# EAGLE design AVC But witn an RP2040 (EAGLE 9.6.2)
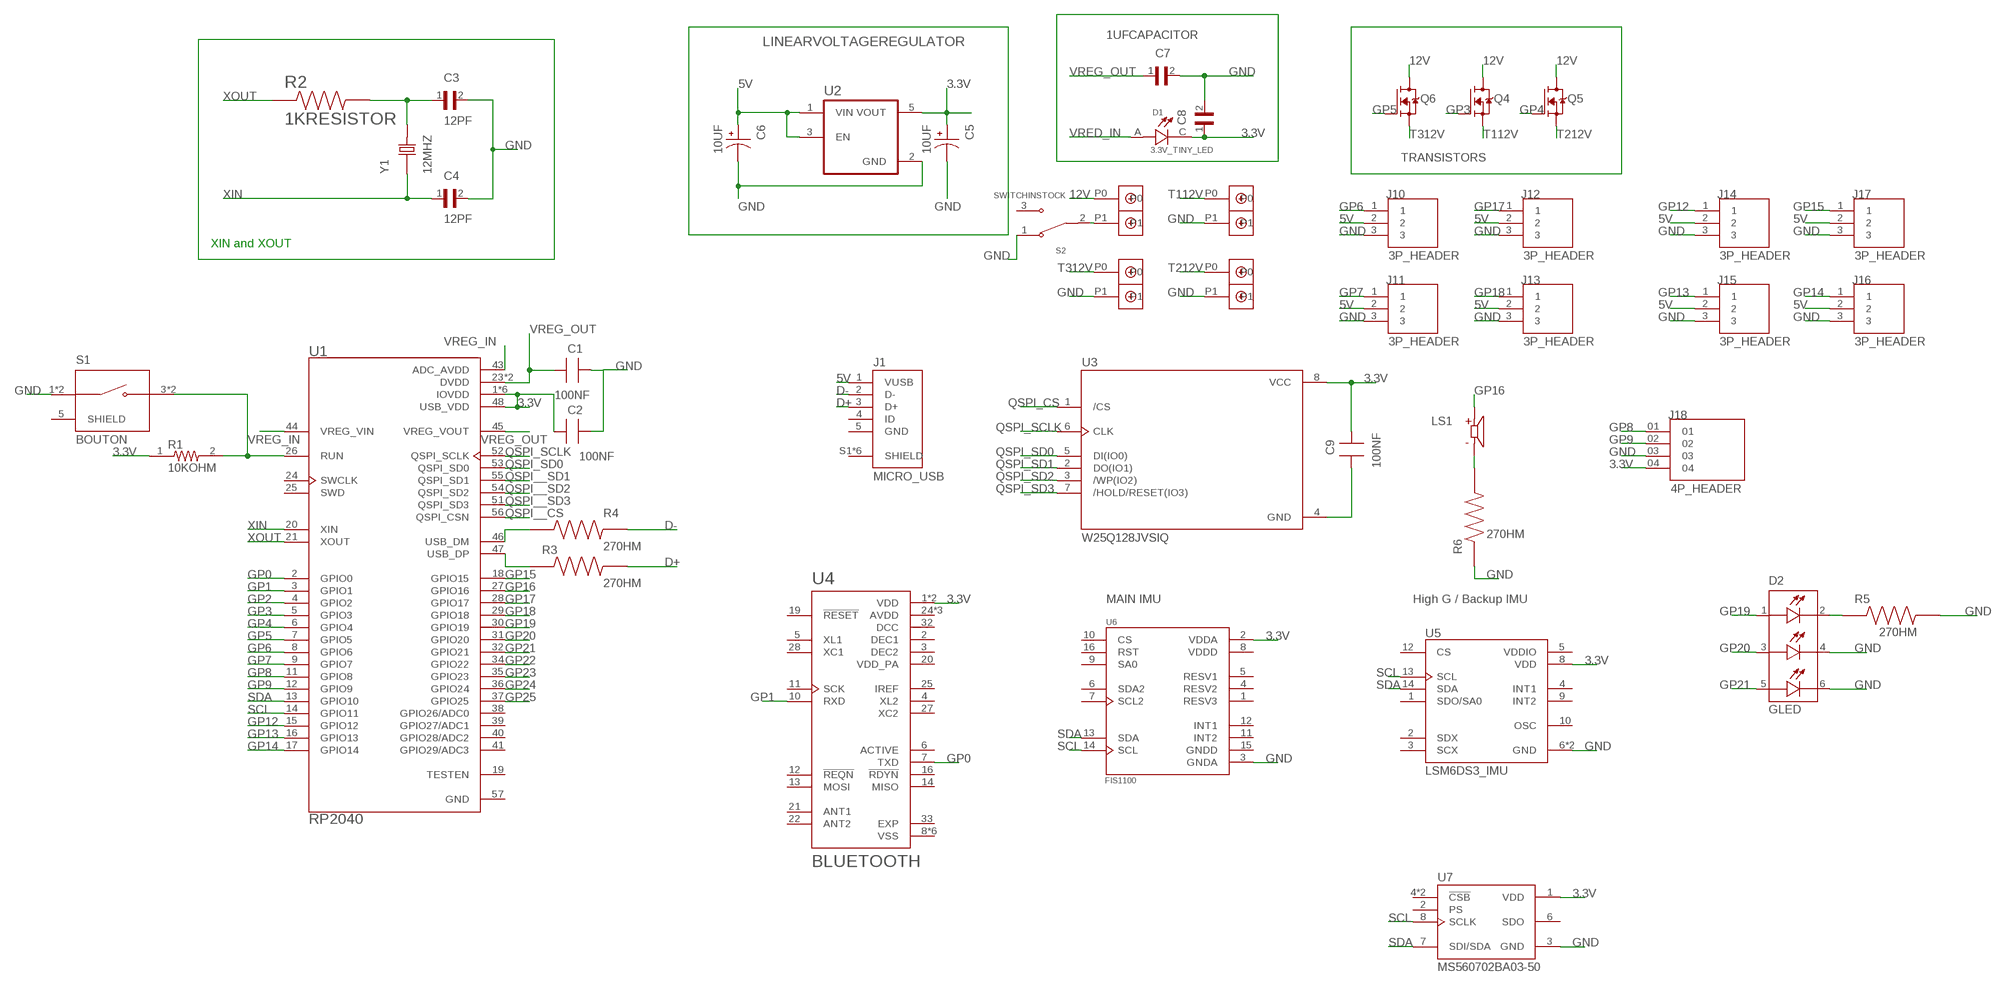
[diagram p0: schematic, sheet 1]

## Parts
C1  100NF  [WCAP-CSST_885382207007]
C2  100NF  [WCAP-CSST_885382207007]
C3  12PF  [CAPC1005X55N]
C4  12PF  [CAPC1005X55N]
C5  10UF  [CAP_EEEFN1J100P]
C6  10UF  [CAP_EEEFN1J100P]
C7  1UFCAPACITOR  [1UFCAPACITOR]
C8  1UFCAPACITOR  [1UFCAPACITOR]
C9  100NF  [WCAP-CSST_885382207007]
D1  3.3V_TINY_LED  [LED_IN-S124ARUW]
D2  GLED  [GLED]
J1  MICRO_USB  [FCI_10118193-0001LF]
J10  3P_HEADER  [3P_HEADER]
J11  3P_HEADER  [3P_HEADER]
J12  3P_HEADER  [3P_HEADER]
J13  3P_HEADER  [3P_HEADER]
J14  3P_HEADER  [3P_HEADER]
J15  3P_HEADER  [3P_HEADER]
J16  3P_HEADER  [3P_HEADER]
J17  3P_HEADER  [3P_HEADER]
J18  4P_HEADER  [4P_HEADER]
LS1  1.5V_BUZZER  [SPKR_PKLCS1212E4001-R1]
Q4  MOSFET20V  [SOT95P240X111-3N]
Q5  MOSFET20V  [SOT95P240X111-3N]
Q6  MOSFET20V  [SOT95P240X111-3N]
R1  10KOHM  [RESC1608X50N]
R2  1KRESISTOR  [1KRESISTOR]
R3  270HM  [RES_ERJU03F27R0V]
R4  270HM  [RES_ERJU03F27R0V]
R5  270HM  [RES_ERJU03F27R0V]
R6  270HM  [RES_ERJU03F27R0V]
S1  BOUTON  [SW_1-1437565-9]
S2  SWITCHINSTOCK  [SW_EG1215AA]
T_BATT  BLACK  [BLACK`]
T_PY1  BLACK  [BLACK`]
T_PY2  BLACK  [BLACK`]
T_PY3  BLACK  [BLACK`]
U1  RP2040  [QFN40P700X700X90-57N]
U2  LINEARVOLTAGEREGULATOR  [SOT95P285X140-5N]
U3  W25Q128JVSIQ  [SOIC127P790X216-8N]
U4  BLUETOOTH  [QFN50P500X500X90-33N]
U5  LSM6DS3_IMU  [PQFN50P300X250X86-14N]
U6  FIS1100  [LGA16R50P4X4_330X330X100]
U7  MS560702BA03-50  [SON125P300X500X100-8N]
Y1  12MHZ  [XTAL_ECS-120-S-5PX-TR]

## Nets
3.3V: C2.1 C5.1 C8.1 C9.2 D1.C J18.04 R1.1 U1.1(IOVDD) U1.10(IOVDD) U1.22(IOVDD) U1.33(IOVDD) U1.42(IOVDD) U1.48(USB_VDD) U1.49(IOVDD) U2.5(VOUT) U3.8(VCC) U4.1(VDD) U4.9(VDD) U5.8(VDD) U6.2(VDDA) U7.1(VDD)
5V: C6.1 J1.1(VUSB) J10.2 J11.2 J12.2 J13.2 J14.2 J15.2 J16.2 J17.2 U2.1(VIN) U2.3(EN)
12V: Q4.3(D) Q5.3(D) Q6.3(D) T_BATT.P0
D+: J1.3(D+) R3.2
D-: J1.2(D-) R4.2
GND: C1.2 C2.2 C3.2 C4.2 C5.2 C6.2 C7.2 C8.2 D2.4(GREEN_CATHODE) D2.6(BLUE_CATHODE) J10.3 J11.3 J12.3 J13.3 J14.3 J15.3 J16.3 J17.3 J18.03 R5.2 R6.1 S1.1(COM) S1.2(COM) S2.1 T_PY1.P1 T_PY2.P1 T_PY3.P1 U2.2(GND) U5.6(GND) U5.7(GND) U6.3(GNDA) U7.3(GND)
GP0: U1.2(GPIO0) U4.7(TXD)
GP1: U1.3(GPIO1) U4.10(RXD)
GP2: U1.4(GPIO2)
GP3: Q4.1(G) U1.5(GPIO3)
GP4: Q5.1(G) U1.6(GPIO4)
GP5: Q6.1(G) U1.7(GPIO5)
GP6: J10.1 U1.8(GPIO6)
GP7: J11.1 U1.9(GPIO7)
GP8: J18.01 U1.11(GPIO8)
GP9: J18.02 U1.12(GPIO9)
GP12: J14.1 U1.15(GPIO12)
GP13: J15.1 U1.16(GPIO13)
GP14: J16.1 U1.17(GPIO14)
GP15: J17.1 U1.18(GPIO15)
GP16: LS1.P U1.27(GPIO16)
GP17: J12.1 U1.28(GPIO17)
GP18: J13.1 U1.29(GPIO18)
GP19: D2.1(RED_ANODE) U1.30(GPIO19)
GP20: D2.3(GREEN_ANODE) U1.31(GPIO20)
GP21: D2.5(BLUE_ANODE) U1.32(GPIO21)
GP22: U1.34(GPIO22)
GP23: U1.35(GPIO23)
GP24: U1.36(GPIO24)
GP25: U1.37(GPIO25)
N$1: R1.2 S1.3(NO) S1.4(NO) U1.26(RUN)
N$2: C3.1 R2.2 Y1.2
N$6: R3.1 U1.47(USB_DP)
N$7: C9.1 U3.4(GND)
N$8: R4.1 U1.46(USB_DM)
N$10: D2.2(RED_CATHODE) R5.1
N$12: LS1.N R6.2
N$13: S2.2 T_BATT.P1
QSPI__CS: U1.56(QSPI_CSN)
QSPI__SD1: U1.55(QSPI_SD1)
QSPI__SD2: U1.54(QSPI_SD2)
QSPI__SD3: U1.51(QSPI_SD3)
QSPI_CS: U3.1(/CS)
QSPI_SCLK: U1.52(QSPI_SCLK) U3.6(CLK)
QSPI_SD0: U1.53(QSPI_SD0) U3.5(DI(IO0))
QSPI_SD1: U3.2(DO(IO1))
QSPI_SD2: U3.3(/WP(IO2))
QSPI_SD3: U3.7(/HOLD/RESET(IO3))
SCL: U1.14(GPIO11) U5.13(SCL) U6.14(SCL) U7.8(SCLK)
SDA: U1.13(GPIO10) U5.14(SDA) U6.13(SDA) U7.7(SDI/SDA)
T112V: Q4.2(S) T_PY1.P0
T212V: Q5.2(S) T_PY2.P0
T312V: Q6.2(S) T_PY3.P0
VRED_IN: D1.A
VREG_IN: U1.43(ADC_AVDD) U1.44(VREG_VIN)
VREG_OUT: C1.1 C7.1 U1.23(DVDD) U1.45(VREG_VOUT) U1.50(DVDD)
XIN: C4.1 U1.20(XIN) Y1.1
XOUT: R2.1 U1.21(XOUT)
Unconnected: J1.4(ID) J1.5(GND) J1.S1(SHIELD) J1.S2(SHIELD) J1.S3(SHIELD) J1.S4(SHIELD) J1.S5(SHIELD) J1.S6(SHIELD) S1.5(SHIELD) S2.3 U1.19(TESTEN) U1.24(SWCLK) U1.25(SWD) U1.38(GPIO26/ADC0) U1.39(GPIO27/ADC1) U1.40(GPIO28/ADC2) U1.41(GPIO29/ADC3) U4.4(XL2) U4.5(XL1) U4.6(ACTIVE) U4.11(SCK) U4.12(!REQN) U4.13(MOSI) U4.14(MISO) U4.16(!RDYN) U4.19(!RESET) U4.20(VDD_PA) U4.21(ANT1) U4.22(ANT2) U4.25(IREF) U4.27(XC2) U4.28(XC1) U5.1(SDO/SA0) U5.2(SDX) U5.3(SCX) U5.4(INT1) U5.9(INT2) U5.10(OSC) U5.12(CS) U6.6(SDA2) U6.7(SCL2) U6.9(SA0) U6.10(CS) U6.11(INT2) U6.12(INT1) U6.16(RST) U7.2(PS) U7.4(!CSB) U7.5(!CSB) U7.6(SDO)

## Notes on the sheet
- TRANSISTORS
- XIN and XOUT
- MAIN IMU | High G / Backup IMU

## Power pins joined to a net without a drawn wire
AVDD: U4.24(AVDD) U4.26(AVDD) U4.29(AVDD)
DCC: U4.32(DCC)
DEC1: U4.2(DEC1)
DEC2: U4.3(DEC2)
EXP: U4.33(EXP)
GND: U1.57(GND)
GNDD: U6.15(GNDD)
RESV1: U6.5(RESV1)
RESV2: U6.4(RESV2)
RESV3: U6.1(RESV3)
VDDD: U6.8(VDDD)
VDDIO: U5.5(VDDIO)
VSS: U4.8(VSS) U4.17(VSS) U4.18(VSS) U4.23(VSS) U4.30(VSS) U4.31(VSS)

## Library data of the parts
C1 C2 C9 = 100NF capacitor:100NF: WCAP-CSST Soft Termination MLCC Characteristics Multilayer ceramic chip capacitors Recommended soldering: Reflow Operating temperature: -55 °C up to +125 °C Capacitance range: 220 pF - 2.2 µF Rated voltage: 16 V(DC) up to 2 kV(DC) Size: 0603, 0805, 1206 and 1210 High absorbtion of mechanical stress Applications Application with high mechanical stress Power supply Lighting <https://katalog.we-online.de/media/images/v2/Family_WCAP-CSST.jpg> Details see: https://katalog.we-online.de/en/pbs/WCAP-CSST#vs_ct:1 Created By Yingchun,Shan 2018-11-14 20178(C) Wurth Elektronik Check availability <https://pricing.snapeda.com/parts/885382207007/Wurth%20Electronics%20Inc/view-part?ref=eda>; AVAILABILITY: In Stock; DESCRIPTION: WCAP-CSST Soft Termination MLCC; SMT 0805; X7R; 100nF 10%; 50V; -55C to +125C; Tech. PN X7R0805104K050DFCT1S000; MF: Wurth Electronics Inc; MP: 885382207007; PACKAGE: 0805 Wurth Electronics; PRICE: None; PURCHASE-URL: https://pricing.snapeda.com/search/part/885382207007/?ref=eda
C3 C4 = 12PF Capacitor:12PF: Check availability <https://pricing.snapeda.com/parts/C0402C120J5HACAUTO/KEMET/view-part?ref=eda>; AVAILABILITY: In Stock; DESCRIPTION: 12 pF ±5% 50V Ceramic Capacitor X8R 0402 (1005 Metric); MF: KEMET; MP: C0402C120J5HACAUTO; PACKAGE: 1005 KEMET; PRICE: None; PURCHASE-URL: https://pricing.snapeda.com/search/part/C0402C120J5HACAUTO/?ref=eda
C5 C6 = 10uF Capacitor:10UF: Check availability <https://pricing.snapeda.com/parts/EEEFN1J100P/Panasonic/view-part?ref=eda>; AVAILABILITY: In Stock; DESCRIPTION: CAP ALUM 10UF 20% 63V SMD; MF: Panasonic; MP: EEEFN1J100P; PACKAGE: RADIAL-2 Panasonic; PRICE: None; PURCHASE-URL: https://pricing.snapeda.com/search/part/EEEFN1J100P/?ref=eda
C7 C8 = 1uf capacitor:1UFCAPACITOR: Check availability <https://pricing.snapeda.com/parts/GCM219R71C105KA37J/Murata/view-part?ref=eda>; AVAILABILITY: In Stock; DESCRIPTION: SMD Capacitor X7R(EIA) with Capacitance: 1.0uF Tol. 10%. Rated Voltage: 16Vdc; MF: Murata; MP: GCM219R71C105KA37J; PACKAGE: 2012 Murata; PRICE: None; PURCHASE-URL: https://pricing.snapeda.com/search/part/GCM219R71C105KA37J/?ref=eda
D1 = 3.3V Discret Led:3.3V_TINY_LED: TOP VIEW / REVERSE MOUNT / 1205 Buy Part <https://snapeda.com/parts/IN-S124ARUW/Inolux/view-part/?ref=eda> Check availability <https://pricing.snapeda.com/parts/IN-S124ARUW/Inolux/view-part?ref=eda>; AVAILABILITY: In Stock; DESCRIPTION: White - LED Indication - Discrete 3.3V 2-SMD, No Lead; MF: Inolux; MP: IN-S124ARUW; PACKAGE: SMD-2 Inolux; PRICE: None; PURCHASE-URL: https://pricing.snapeda.com/search/part/IN-S124ARUW/?ref=eda
D2 = LED:GLED: Check prices <https://pricing.snapeda.com/parts/L1MC-RGB0035000MP0/Lumileds%20Holding%20B.V./view-part?ref=eda>; AVAILABILITY: In Stock; DESCRIPTION: Standard LEDs - SMD LUXEON MultiColor RGB Module 0.5W; MF: Lumileds Holding B.V.; MP: L1MC-RGB0035000MP0; PACKAGE: None; PRICE: None; PURCHASE-URL: https://pricing.snapeda.com/search/part/L1MC-RGB0035000MP0/?ref=eda
J1 = Micro_USB:MICRO_USB: Micro USB B Type Receptacle Check availability <https://pricing.snapeda.com/parts/10118193-0001LF/FCI/view-part?ref=eda>; AVAILABILITY: In Stock; DESCRIPTION: USB - micro B USB 2.0 Receptacle Connector 5 Position Surface Mount, Right Angle; Through Hole; MF: FCI; MP: 10118193-0001LF; PACKAGE: None; PRICE: None; PURCHASE-URL: https://pricing.snapeda.com/search/part/10118193-0001LF/?ref=eda
J10-J17 = 3P Header:3P_HEADER: Check availability <https://pricing.snapeda.com/parts/2355181-3/TE%20Connectivity/view-part?ref=eda>; AVAILABILITY: In Stock; COMMENT: 2355181-3; DESCRIPTION: Pin 3P,2MM,BRK HDR,SRVT,2.8,0.38AU,BOX 3 POS; MF: TE Connectivity; MP: 2355181-3; PACKAGE: None; PRICE: None; PURCHASE-URL: https://pricing.snapeda.com/search/part/2355181-3/?ref=eda
J18 = 4P Header:4P_HEADER: Check availability <https://pricing.snapeda.com/parts/TSW-104-24-G-S/Samtec/view-part?ref=eda>; AVAILABILITY: In Stock; DESCRIPTION: Connector Header Through Hole 4 position 0.100 (2.54mm); MF: Samtec; MP: TSW-104-24-G-S; PACKAGE: None; PRICE: None; PURCHASE-URL: https://pricing.snapeda.com/search/part/TSW-104-24-G-S/?ref=eda
LS1 = 1.5V_BUZZER:1.5V_BUZZER: Buzzers Transducer, Externally Driven Piezo 1.5V 2kHz 70dB @ 1.5V, 10cm Surface Mount Solder Pads Check availability <https://pricing.snapeda.com/parts/PKLCS1212E4001-R1/Murata/view-part?ref=eda>; AVAILABILITY: In Stock; DESCRIPTION: Buzzers Transducer, Externally Driven Piezo 1.5 V - 4kHz 84dB @ 1.5V, 10cm Surface Mount Solder Pads; MF: Murata; MP: PKLCS1212E4001-R1; PACKAGE: SMD-2 Murata; PRICE: None; PURCHASE-URL: https://pricing.snapeda.com/search/part/PKLCS1212E4001-R1/?ref=eda
Q4-Q6 = MOSFET 20V:MOSFET20V: N-Channel 20V 900mA (Ta) 350mW (Ta) Surface Mount SOT-23 Check availability <https://pricing.snapeda.com/parts/FDV305N/ON/view-part?ref=eda>; AVAILABILITY: In Stock; DESCRIPTION: FD V305N Series N-Channel 20 V 220 mOhm SMT PowerTrench Mosfet - SOT-23-3; MF: ON; MP: FDV305N; PACKAGE: SOT-23-3 Fairchild Semiconductor; PRICE: None; PURCHASE-URL: https://pricing.snapeda.com/search/part/FDV305N/?ref=eda
R1 = 10K OHM Resistor:10KOHM: RP 1J 0.166W 10K 0.1% 25PPM 1K RL Check availability <https://pricing.snapeda.com/parts/RP73PF1J10KBTDF/TE%20Connectivity/view-part?ref=eda>; AVAILABILITY: In Stock; COMMENT: 1625867-2; DESCRIPTION: Thin Film Resistors - SMD 10K OHM .1% 25PPM; MF: TE Connectivity; MP: RP73PF1J10KBTDF; PACKAGE: 0603; PRICE: None; PURCHASE-URL: https://pricing.snapeda.com/search/part/RP73PF1J10KBTDF/?ref=eda
R2 = 1KRESISTOR:1KRESISTOR: RES 1K OHM 1W 5% 2512 Check availability <https://pricing.snapeda.com/parts/35201K0JT/TE%20Connectivity/view-part?ref=eda>; AVAILABILITY: In Stock; COMMENT: 1-1622820-4; DESCRIPTION: RES 1K OHM 1W 5% 2512; EU_ROHS_COMPLIANCE: Compliant with Exemptions; MF: TE Connectivity; MP: 35201K0JT; PACKAGE: 2512; POWER_RATING: 1 W; PRICE: None; PURCHASE-URL: https://pricing.snapeda.com/search/part/35201K0JT/?ref=eda; RESISTANCE: 1K; TOLERANCE: 5%; VOLTAGE_RATING: 200 V
R3-R6 = 27OHM Resistor:270HM: Check availability <https://pricing.snapeda.com/parts/ERJ-U03F27R0V/Panasonic/view-part?ref=eda>; AVAILABILITY: In Stock; DESCRIPTION: RES 27 OHM 1% 1/10W 0603 SMD; MF: Panasonic; MP: ERJ-U03F27R0V; PACKAGE: 1608-2 Panasonic; PRICE: None; PURCHASE-URL: https://pricing.snapeda.com/search/part/ERJ-U03F27R0V/?ref=eda
S1 = bouton:BOUTON: Tactile Switch SPST-NO Top Actuated Surface Mount Check availability <https://pricing.snapeda.com/parts/1-1437565-9/TE%20Connectivity/view-part?ref=eda>; AVAILABILITY: In Stock; COMMENT: 1-1437565-9; DESCRIPTION: Tactile Switch SPST-NO Top Actuated Surface Mount; MF: TE Connectivity; MP: 1-1437565-9; PACKAGE: None; PRICE: None; PURCHASE-URL: https://pricing.snapeda.com/search/part/1-1437565-9/?ref=eda
S2 = SWITCH IN STI_OCK:SWITCHINSTOCK: Slide Switch SPDT Surface Mount, Right Angle Check availability <https://pricing.snapeda.com/parts/EG1215AA/E-Switch/view-part?ref=eda>; AVAILABILITY: In Stock; DESCRIPTION: Slide Switch SPDT Surface Mount, Right Angle; MF: E-Switch; MP: EG1215AA; PACKAGE: None; PRICE: None; PURCHASE-URL: https://pricing.snapeda.com/search/part/EG1215AA/?ref=eda
T_BATT T_PY1-T_PY3 = black Thermalblock copy:BLACK
U1 = RP2040:RP2040: Check availability <https://pricing.snapeda.com/parts/RP2040/Raspberry%20Pi/view-part?ref=eda>; AVAILABILITY: In Stock; DESCRIPTION: RP2040 chip for Raspberry Pi Pico - ARM® Cortex®-M0+ MCU 32-Bit; MF: Raspberry Pi; MP: RP2040; PACKAGE: None; PRICE: None; PURCHASE-URL: https://pricing.snapeda.com/search/part/RP2040/?ref=eda
U2 = Linear Voltage Regulator:LINEARVOLTAGEREGULATOR: AP2112 Series 0.6 A 3.3 V Fixed Output SMT LDO Linear Regulator - SOT23-5 Check availability <https://pricing.snapeda.com/parts/AP2112K-3.3TRG1/Diodes%20Inc./view-part?ref=eda>; AVAILABILITY: In Stock; DESCRIPTION: Linear Voltage Regulator IC Positive Fixed 1 Output 600mA SOT-25; MF: Diodes Inc.; MP: AP2112K-3.3TRG1; PACKAGE: SOT-753 Diodes Inc.; PRICE: None; PURCHASE-URL: https://pricing.snapeda.com/search/part/AP2112K-3.3TRG1/?ref=eda
U3 = W25Q128JVS Flash memory :W25Q128JVSIQ: Check availability <https://pricing.snapeda.com/parts/W25Q128JVSIQ/Winbond%20Electronics/view-part?ref=eda>; AVAILABILITY: In Stock; DESCRIPTION: FLASH - NOR Memory IC 128Mb (16M x 8) SPI - Quad I/O, QPI, DTR 133 MHz 8-SOIC; MF: Winbond Electronics; MP: W25Q128JVSIQ; PACKAGE: SOIC-8 Winbond; PRICE: None; PURCHASE-URL: https://pricing.snapeda.com/search/part/W25Q128JVSIQ/?ref=eda
U4 = Bluetooth module:BLUETOOTH: Bluetooth Class II 3V 1Mbps 32-Pin QFN EP Tray Check availability <https://pricing.snapeda.com/parts/NRF8001-R2Q32-R/Nordic%20Semiconductor/view-part?ref=eda>; AVAILABILITY: In Stock; DESCRIPTION: IC RF TxRx Only Bluetooth Bluetooth v4.0 2.4GHz 32-VFQFN Exposed Pad; MF: Nordic Semiconductor; MP: NRF8001-R2Q32-R; PACKAGE: VFQFN-32 Nordic Semiconductor; PRICE: None; PURCHASE-URL: https://pricing.snapeda.com/search/part/NRF8001-R2Q32-R/?ref=eda
U5 = LSM6DS3 IMU:LSM6DS3_IMU: iNEMO inertial module: 3D accelerometer and 3D gyroscope Check availability <https://pricing.snapeda.com/parts/LSM6DS3/STMicroelectronics/view-part?ref=eda>; AVAILABILITY: In Stock; DESCRIPTION: Accelerometer, Gyroscope, Temperature, 6 Axis Sensor I²C, SPI Output; MF: STMicroelectronics; MP: LSM6DS3; PACKAGE: Package; PRICE: None; PURCHASE-URL: https://pricing.snapeda.com/search/part/LSM6DS3/?ref=eda
U6 = FIS1100 IMU:FIS1100: Ic Mems Intertial Measure 16lga Check availability <https://pricing.snapeda.com/parts/FIS1100/ON%20Semiconductor/view-part?ref=eda>; AVAILABILITY: In Stock; DESCRIPTION: Accelerometer, Gyroscope, 6 Axis Sensor I²C Output; MF: ON Semiconductor; MP: FIS1100; PACKAGE: LGA-16 Fairchild Semiconductor; PRICE: None; PURCHASE-URL: https://pricing.snapeda.com/search/part/FIS1100/?ref=eda
U7 = BMP:MS560702BA03-50: BAROMETRIC PRESSURE SENSOR Check prices <https://pricing.snapeda.com/parts/MS560702BA03-50/TE%20Connectivity/view-part?ref=eda>; AVAILABILITY: In Stock; COMMENT: MS560702BA03-50; DESCRIPTION: MS5607-02BA03 Series 3 V 1 to 120 kPa Absolute Barometric Pressure Sensor; EU_ROHS_COMPLIANCE: Compliant; MF: TE Connectivity; MP: MS560702BA03-50; PACKAGE: SMD-8 TE Connectivity; PRICE: None; PURCHASE-URL: https://pricing.snapeda.com/search/part/MS560702BA03-50/?ref=eda
Y1 = 12MHz cristal:12MHZ: CRYSTAL SMD Check availability <https://pricing.snapeda.com/parts/ECS-120-S-5PX-TR/ECS%20Inc./view-part?ref=eda>; AVAILABILITY: In Stock; DESCRIPTION: 12 MHz ±30ppm Crystal Series 50 Ohms HC-49/US; MF: ECS Inc.; MP: ECS-120-S-5PX-TR; PACKAGE: HC49/US ECS International; PRICE: None; PURCHASE-URL: https://pricing.snapeda.com/search/part/ECS-120-S-5PX-TR/?ref=eda

## Board
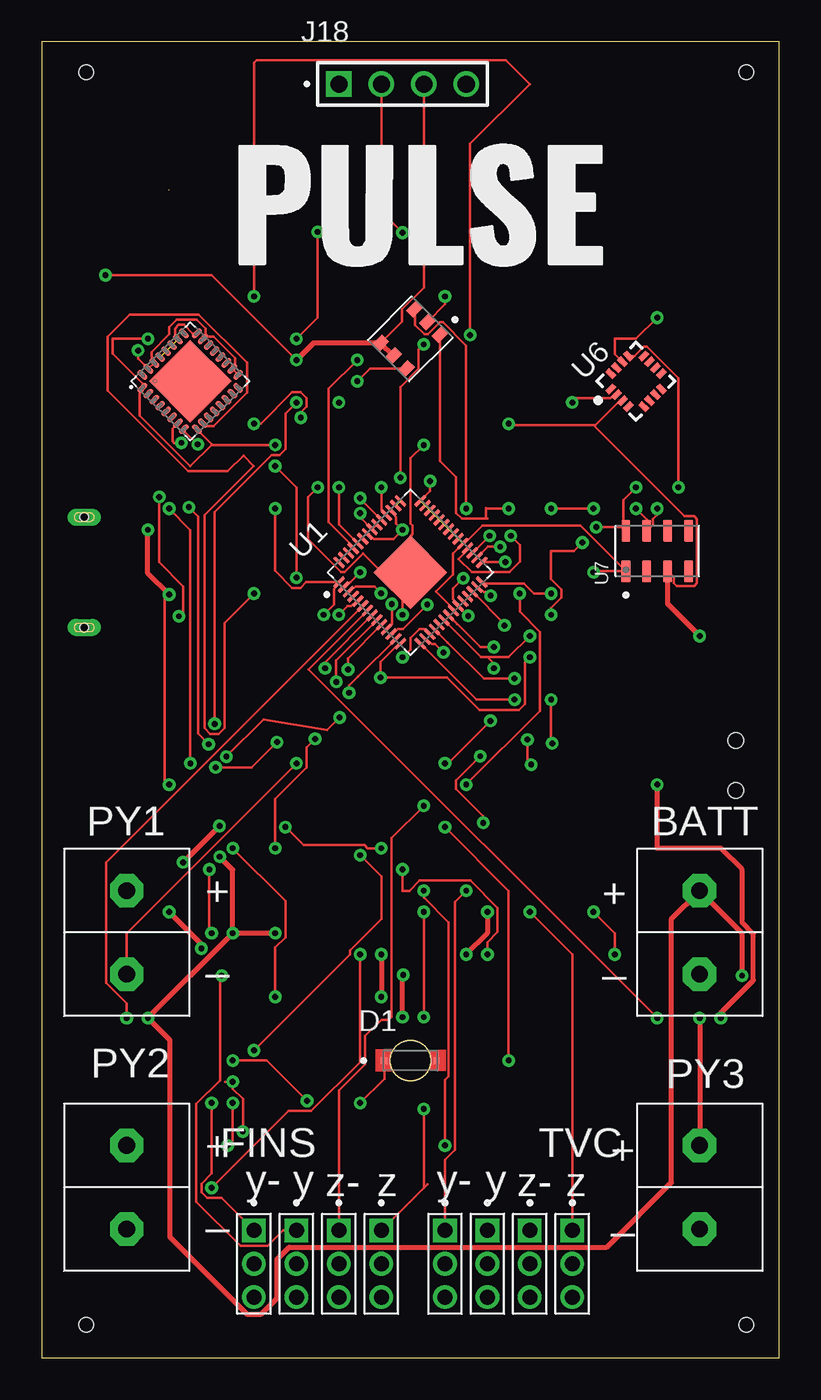
[diagram p1: board, top side]
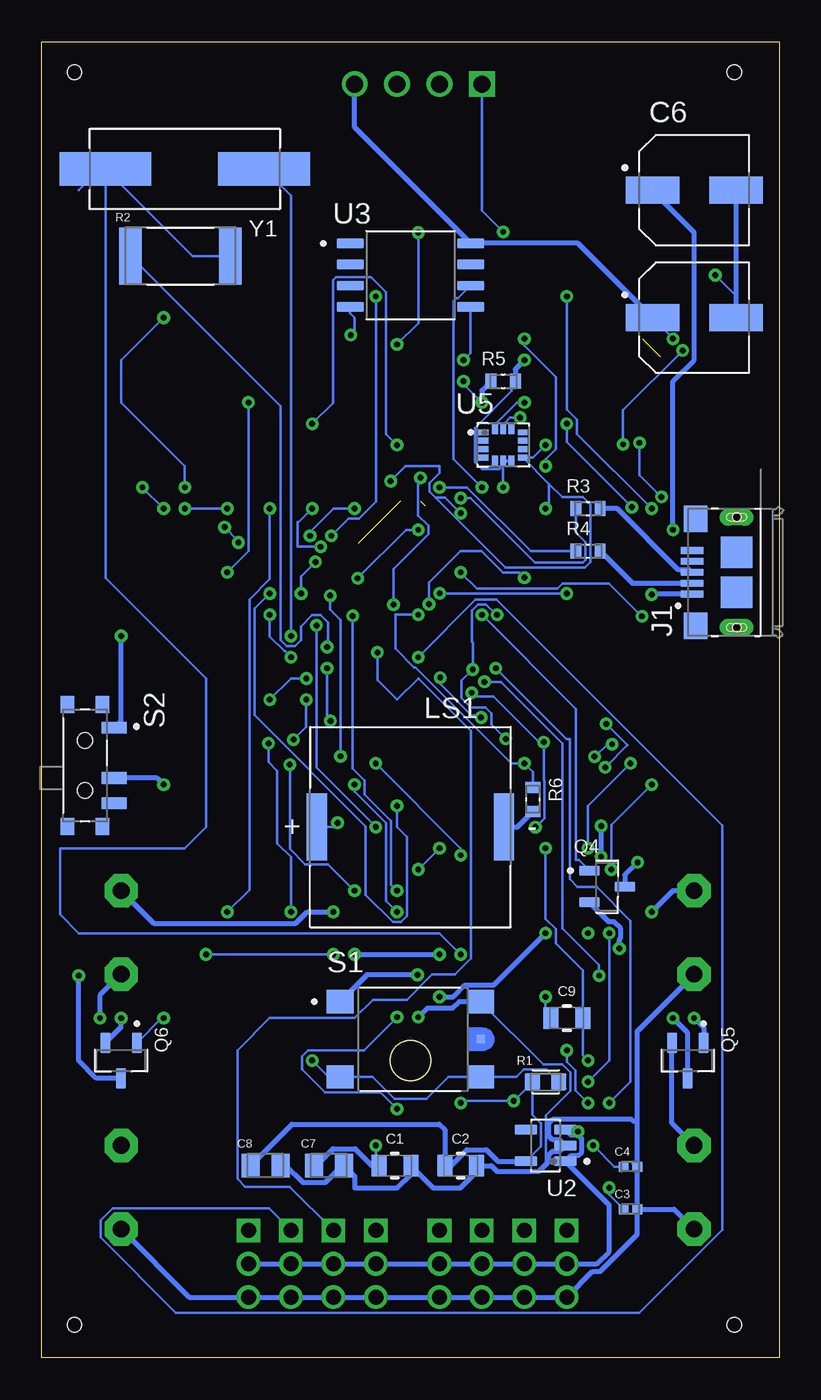
[diagram p2: board, bottom side, seen from below]

Size 44.12 x 78.73 mm. Coordinates in mm from the lower left corner, seen from the top.
Outline: 0,0 44.12,0 44.12,78.73 0,78.73 0,0
Copper layers (1*16): Top 0.035mm / dielectric 1.5mm / Bottom 0.035mm
Design rules "default": minimum track width 6mil, minimum drill 0.35mm, track to track 6mil, track to pad 6mil, pad to pad 6mil, via to via 6mil, smd to smd 6mil, copper to edge 40mil, drill to drill 6mil, minimum pad ring 10mil, minimum via ring 8mil, stop-mask expansion 4mil, vias tented up to drill 0mil, thermal gap 10mil
Holes 0.85 mm at 2.67,76.9 42.16,76.9 2.67,1.97 42.16,1.97

### Footprints (pad centres in the part's own frame; a part is rotated, then mirrored left to right if it is on the bottom)
WCAP-CSST_885382207007 = smd 0.9 x 1.3: 1 -0.95,0; 2 0.95,0
CAPC1005X55N = smd 0.59 x 0.6: 1 -0.407,0; 2 0.407,0
CAP_EEEFN1J100P = smd 3.2 x 1.6: 1 -2.5,0; 2 2.5,0
1UFCAPACITOR = smd 1.08 x 1.42: 1 -0.895,0; 2 0.895,0
LED_IN-S124ARUW = smd 0.381 x 0.381: A 1.56,0; C -1.56,0 | hole 2.4: 0,0
GLED = smd 0.84 x 0.6: 1 -1.43,1.08; 2 1.43,1.08; 3 -1.43,0; 4 1.43,0; 5 -1.43,-1.08; 6 1.43,-1.08
FCI_10118193-0001LF = smd 0.4 x 1.35: 1 -1.3,2.675; 2 -0.65,2.675; 3 0,2.675; 4 0.65,2.675; 5 1.3,2.675 | smd 1.6 x 1.4: S1 -3.2,2.45; S2 3.2,2.45 | smd 1.9 x 1.9: S3 1.2,0; S4 -1.2,0 | drill 0.5 pad 0.9 long: S5 -3.3,0; S6 3.3,0 | hole 0.5: -3.3,0; 3.3,0
3P_HEADER = drill 0.9 pad 1.25 square: 1 0,0 | drill 0.9 pad 1.25: 2 2,0; 3 4,0
4P_HEADER = drill 1.02 pad 1.37 square: 01 0,0 | drill 1.02 pad 1.37: 02 2.54,0; 03 5.08,0; 04 7.62,0
SPKR_PKLCS1212E4001-R1 = smd 1.2 x 4: N 5.6,0; P -5.6,0
SOT95P240X111-3N = smd 1.23 x 0.6: 1 -1.06,0.95; 2 -1.06,-0.95; 3 1.06,0
RESC1608X50N = smd 0.94 x 1.02: 1 -0.79,0; 2 0.79,0
1KRESISTOR = smd 1.34 x 3.42: 1 -2.99,0; 2 2.99,0
RES_ERJU03F27R0V = smd 0.65 x 0.9: 1 -0.725,0; 2 0.725,0
SW_1-1437565-9 = smd 1.6 x 1.395: 1 -4.205,2.248; 2 4.205,2.248; 3 -4.205,-2.248; 4 4.205,-2.248 | smd 0.5 x 0.5: 5 4.205,0
SW_EG1215AA = smd 0.7 x 1.5: 1 -2.25,1.75; 2 0.75,1.75; 3 2.25,1.75 | smd 1 x 0.8: S1 -3.65,1.05; S2 -3.65,-1.05; S3 3.65,-1.05; S4 3.65,1.05 | hole 0.9: -1.5,0; 1.5,0
BLACK` = drill 1 pad 2 octagon: P0 -2.54,0; P1 2.46,0
QFN40P700X700X90-57N = smd 0.84 x 0.2: 1 -3.435,2.6; 2 -3.435,2.2; 3 -3.435,1.8; 4 -3.435,1.4; 5 -3.435,1; 6 -3.435,0.6; 7 -3.435,0.2; 8 -3.435,-0.2; 9 -3.435,-0.6; 10 -3.435,-1; 11 -3.435,-1.4; 12 -3.435,-1.8; 13 -3.435,-2.2; 14 -3.435,-2.6; 29 3.435,-2.6; 30 3.435,-2.2; 31 3.435,-1.8; 32 3.435,-1.4; 33 3.435,-1; 34 3.435,-0.6; 35 3.435,-0.2; 36 3.435,0.2; 37 3.435,0.6; 38 3.435,1; 39 3.435,1.4; 40 3.435,1.8; 41 3.435,2.2; 42 3.435,2.6 | smd 0.2 x 0.84: 15 -2.6,-3.435; 16 -2.2,-3.435; 17 -1.8,-3.435; 18 -1.4,-3.435; 19 -1,-3.435; 20 -0.6,-3.435; 21 -0.2,-3.435; 22 0.2,-3.435; 23 0.6,-3.435; 24 1,-3.435; 25 1.4,-3.435; 26 1.8,-3.435; 27 2.2,-3.435; 28 2.6,-3.435; 43 2.6,3.435; 44 2.2,3.435; 45 1.8,3.435; 46 1.4,3.435; 47 1,3.435; 48 0.6,3.435; 49 0.2,3.435; 50 -0.2,3.435; 51 -0.6,3.435; 52 -1,3.435; 53 -1.4,3.435; 54 -1.8,3.435; 55 -2.2,3.435; 56 -2.6,3.435 | smd 3.1 x 3.1: 57 0,0
SOT95P285X140-5N = smd 1.35 x 0.6: 1 -1.185,0.95; 2 -1.185,0; 3 -1.185,-0.95; 4 1.185,-0.95; 5 1.185,0.95
SOIC127P790X216-8N = smd 1.61 x 0.58: 1 -3.605,1.905; 2 -3.605,0.635; 3 -3.605,-0.635; 4 -3.605,-1.905; 5 3.605,-1.905; 6 3.605,-0.635; 7 3.605,0.635; 8 3.605,1.905
QFN50P500X500X90-33N = smd 0.7 x 0.3: 1 -2.3,1.75; 2 -2.3,1.25; 3 -2.3,0.75; 4 -2.3,0.25; 5 -2.3,-0.25; 6 -2.3,-0.75; 7 -2.3,-1.25; 8 -2.3,-1.75; 17 2.3,-1.75; 18 2.3,-1.25; 19 2.3,-0.75; 20 2.3,-0.25; 21 2.3,0.25; 22 2.3,0.75; 23 2.3,1.25; 24 2.3,1.75 | smd 0.3 x 0.7: 9 -1.75,-2.3; 10 -1.25,-2.3; 11 -0.75,-2.3; 12 -0.25,-2.3; 13 0.25,-2.3; 14 0.75,-2.3; 15 1.25,-2.3; 16 1.75,-2.3; 25 1.75,2.3; 26 1.25,2.3; 27 0.75,2.3; 28 0.25,2.3; 29 -0.25,2.3; 30 -0.75,2.3; 31 -1.25,2.3; 32 -1.75,2.3 | smd 3.5 x 3.5: 33 0,0
PQFN50P300X250X86-14N = smd 0.58 x 0.35: 1 -1.175,0.75; 2 -1.175,0.25; 3 -1.175,-0.25; 4 -1.175,-0.75; 8 1.175,-0.75; 9 1.175,-0.25; 10 1.175,0.25; 11 1.175,0.75 | smd 0.35 x 0.58: 5 -0.5,-0.925; 6 0,-0.925; 7 0.5,-0.925; 12 0.5,0.925; 13 0,0.925; 14 -0.5,0.925
LGA16R50P4X4_330X330X100 = smd 0.61 x 0.32: 1 -1.395,0.75; 2 -1.395,0.25; 3 -1.395,-0.25; 4 -1.395,-0.75; 9 1.395,-0.75; 10 1.395,-0.25; 11 1.395,0.25; 12 1.395,0.75 | smd 0.32 x 0.61: 5 -0.75,-1.395; 6 -0.25,-1.395; 7 0.25,-1.395; 8 0.75,-1.395; 13 0.75,1.395; 14 0.25,1.395; 15 -0.25,1.395; 16 -0.75,1.395
SON125P300X500X100-8N = smd 1.31 x 0.53: 1 -1.2,1.875; 2 -1.2,0.625; 3 -1.2,-0.625; 4 -1.2,-1.875; 5 1.2,-1.875; 6 1.2,-0.625; 7 1.2,0.625; 8 1.2,1.875
XTAL_ECS-120-S-5PX-TR = smd 5.5 x 2: 1 -4.75,0; 2 4.75,0

### Placement (x,y rotation side)
C1  22.99,11.49 0 bottom
C2  19.05,11.49 0 bottom
C3  8.89,8.89 0 bottom
C4  8.89,11.43 0 bottom
C5  5.08,62.23 0 bottom
C6  5.08,69.85 0 bottom
C7  26.92,11.49 0 bottom
C8  30.73,11.49 0 bottom
C9  12.7,20.32 0 bottom
D1  22.06,17.78 0 top
D2  22.06,60.96 225 top
J1  2.54,46.99 90 bottom
J10  12.7,7.62 270 top
J11  15.24,7.62 270 top
J12  17.78,7.62 270 top
J13  20.32,7.62 270 top
J14  24.13,7.62 270 top
J15  26.67,7.62 270 top
J16  29.21,7.62 270 top
J17  31.75,7.62 270 top
J18  17.78,76.2 0 top
LS1  22.06,31.75 0 bottom
Q4  10.29,28.19 0 bottom
Q5  5.46,17.78 270 bottom
Q6  39.37,17.78 270 bottom
R1  13.97,16.51 0 bottom
R2  35.81,65.91 0 bottom
R3  11.43,50.8 0 bottom
R4  11.43,48.26 0 bottom
R5  16.51,58.42 0 bottom
R6  14.73,33.4 270 bottom
S1  22.06,19.05 0 bottom
S2  41.53,35.43 270 bottom
T_BATT  39.37,25.4 270 top
T_PY1  5.08,25.4 270 top
T_PY2  5.08,10.16 270 top
T_PY3  39.37,10.16 270 top
U1  22.06,46.99 45 top
U2  13.97,12.7 180 bottom
U3  22.06,64.77 0 bottom
U4  8.89,58.42 45 top
U5  16.51,54.61 0 bottom
U6  35.56,58.42 45 top
U7  36.83,48.26 90 top
Y1  35.56,71.12 180 bottom

### Tracks (layer width: path | path; a pad name or v marks a point on that pad's centre or on a via)
3.3V  (via drill 0.35)  (1 unrouted)
  Top 0.152: v11.43,17.78 13.46,17.78 v15.88,15.37 | D1.C 20.5,16.69 v19.05,15.24 | U1.22 24.63,44.8 23.59,45.85 24.61,46.87 24.61,48.13 U1.33 25.3,48.71 26.36,49.78 32.24,49.78 U7.1 33.09,47.06 v33.02,46.99 | U1.49 | U1.49 U1.48 | U1.49 19.05,50.28 v19.05,50.53 | v23.24,52.45 23.24,51.85 U1.42 | v6.35,60.96 4.24,60.96 4.24,60.06 6.03,58.27 U4.1 6.03,57.86 5.86,57.69 5.86,56.37 8.89,53.34 10.16,54.61 | 10.16,54.61 10.16,54.67 U4.9 | 10.16,54.61 v13.97,54.61 | v16.87,44.45 17.49,45.07 17.49,45.99 17.79,46.3 U1.1 15.83,46.4 15.49,46.06 14.99,46.06 13.97,47.08 v13.97,50.8 | U6.2 34.24,57.61 34.03,57.41 32.01,57.41 v31.75,57.15 | v18.33,41.17 18.33,41.85 U1.10 | v13.97,30.48 13.97,33.43 15.85,35.31 15.85,36.52 v16.35,37.03
  Bottom 0.152: U2.5 14.25,12.65 14.25,14.02 14.76,14.53 R1.1 14.76,16.48 v15.88,15.37 18.92,15.37 v19.05,15.24 | v11.43,17.78 11.75,18.1 C9.2 11.75,23.18 13.36,24.79 13.36,25.65 13.97,26.26 v13.97,30.48 | 20.57,51.46 19.99,51.46 v19.05,50.53 | v6.35,60.96 6.35,61 7.6,62.25 | v13.97,54.61 14.72,53.86 U5.8 13.76,52.28 | 13.76,52.28 12.95,51.48 11.73,51.48 11.3,51.04 11.3,47.59 11.61,47.28 16.39,47.28 20.57,51.46 | v16.87,44.45 16.92,44.45 17.53,45.06 18.03,45.06 18.39,44.7 18.39,42.82 18.33,42.77 v18.33,41.17 18.99,40.51 18.99,39.46 18.45,38.91 17.58,38.91 17.22,38.56 17.22,37.9 v16.35,37.03 | v33.02,46.99 31.75,48.26 v31.75,57.15 | 20.57,51.46 20.93,51.82 20.93,52.32 20.32,52.93 20.32,53.34 22.35,53.34 v23.24,52.45 | v13.97,50.8 13.76,51.01 13.76,52.28
  Bottom 0.305: C8.1 29.15,13.97 20.32,13.97 20,13.65 C2.1 19.63,11.49 18.68,12.45 17.52,12.45 16.82,11.75 U2.5 | C5.1 7.6,62.25 12.03,66.67 U3.8 25.4,73.62 J18.04
5V  (via drill 0.35)  (1 unrouted)
  Top 0.152: v12.04,13.53 12.04,15.49 11.43,16.1 v11.43,16.51 10.97,16.51 | v10.16,25.4 10.03,25.53 v10.03,29.21 | v7.62,34.29 7.37,34.54 7.37,45.4 v7.62,45.66
  Top 0.305: v7.62,45.66 6.35,46.93 v6.35,49.53
  Bottom 0.152: U2.3 12.16,13.65 v12.04,13.53 | v11.43,16.51 10.16,17.78 v10.16,25.4 | v10.03,29.21 10.03,31.88 v7.62,34.29
  Bottom 0.305: J17.2 J16.2 J15.2 J14.2 J13.2 J12.2 J11.2 J10.2 10.89,5.62 10.16,6.35 10.16,9.12 U2.1 12.44,12.1 12.01,12.1 11.8,12.3 11.8,13.1 12.01,13.3 12.44,13.3 U2.3 | J1.1 7.59,45.69 v7.62,45.66 | v6.35,49.53 6.35,58.42 5.08,59.69 5.08,67.31 7.62,69.85
12V  (via drill 0.35)
  Top 0.305: v11.43,25.4 v6.35,20.32 7.66,19.01 7.66,7.23 12.28,2.61 13.12,2.61 14.07,3.56 14.07,5.88 14.8,6.61 33.8,6.61 37.69,10.49 37.69,26.26 T_BATT.P0 41.91,25.4 v41.91,22.86 | v26.67,26.67 26.67,25.4 v25.4,24.13 | v20.32,24.13 v20.32,21.59 | v13.97,25.4 v11.43,25.4 | v11.43,25.4 11.43,29.2 v10.65,29.98 | v10.64,31.81 v8.46,29.64
  Bottom 0.305: v26.67,26.67 28.24,26.67 28.93,25.99 37.42,25.99 T_BATT.P0 | v25.4,24.13 v20.32,24.13 | v13.97,25.4 17.07,22.3 18.78,22.3 19.49,21.59 v20.32,21.59 | 6.41,20.26 v6.35,20.32 5.46,19.43 Q5.3 | v10.65,29.98 10.64,29.99 v10.64,31.81 | v8.46,29.64 9.23,28.87 Q4.3 | Q6.3 40.85,16.72 41.91,17.78 v41.91,22.86
AVDD  (1 unrouted)
  Top 0.152: U4.26 8.15,61.1 7.98,61.27 7.98,61.58 8.2,61.8 8.52,61.8 9.04,61.28 U4.24
D+
  Bottom 0.305: J1.3 5.36,47.13 6.02,47.13 9.68,50.8 R3.2
D-
  Bottom 0.305: R4.2 8.79,46.34 J1.2
GND  (via drill 0.35)
  Top 0.152: v16.51,52.07 15.94,51.5 15.94,48.97 17.91,46.99 18.12,46.99 19.23,48.1 19.23,48.13 20.36,46.99 U1.57 | v3.81,64.77 10.16,64.77 v15.24,59.69 | D2.6 21.57,62 21.57,62.74 22.86,64.03 J18.03 | v15.24,35.56 5.08,25.4 T_PY1.P1 | v21.59,44.45 21.59,46.52 U1.57 | U1.57 22.06,49.14 22.2,49.28 22.2,49.78 22.06,49.91 22.06,53.81 v22.86,54.61 | U6.3 34.59,57.26 33.12,55.78 33.02,55.78 | v27.94,55.88 28.04,55.78 33.02,55.78 | 33.02,55.78 38.46,50.34 39.04,50.34 39.2,50.19 39.2,46.34 39.04,46.18 37.99,46.18 37.82,46.35 37.82,46.7 U7.3
  Top 0.305: D2.4 D2.6 16.26,60.71 v15.24,59.69 | D2.4 | v21.59,20.37 21.59,22.86 v21.63,22.9 | v39.37,43.18 37.45,45.09 U7.3
  Bottom 0.152: C2.2 17.11,11.49 16.84,11.22 14.41,11.22 13.95,11.69 13.95,14.49 12.48,15.96 12.48,17.06 12.97,17.55 14.11,17.55 S1.2 | v16.51,52.07 U5.6 U5.7 16.22,53.69 16.74,53.17 17.78,53.17 18.2,53.59 18.2,55.63 16.01,57.82 16.01,58.2 R5.2 | C5.2 2.58,63.54 v3.81,64.77 | R6.1 14.73,35.05 v15.24,35.56 16,35.56 21.75,41.3 21.84,41.3 22.96,42.42 22.96,44.45 v21.59,44.45 | v22.86,54.61 23.52,55.27 23.52,63.75 24.43,64.65 26.52,64.65 26.7,64.48 26.7,57.12 v27.94,55.88 | 8.71,14.15 8.53,13.97 8.48,13.97
  Bottom 0.305: C3.2 6.27,8.89 T_PY2.P1 | T_PY3.P1 35.29,3.62 J17.3 J16.3 J15.3 J14.3 J13.3 J12.3 J11.3 J10.3 11.16,5.16 10.7,5.16 8.48,7.38 C3.2 | C3.2 C4.2 | C8.2 29.5,11.49 28.48,10.48 27.15,10.48 26.14,11.49 C7.2 25.4,10.86 25.4,10.16 22.86,10.16 22.04,10.98 C1.2 20.7,10.16 19.05,10.16 18.1,11.11 C2.2 17.22,11.49 16.87,11.14 14.38,11.14 13.77,11.76 13.77,12.15 13.56,12.36 13.13,12.36 U2.2 13.13,13.04 13.56,13.04 13.77,13.25 13.77,14.05 13.56,14.26 8.81,14.26 8.71,14.15 8.7,14.14 | 8.7,11.64 C4.2 | C4.2 8.48,13.97 8.48,19.54 T_PY1.P1 | C6.2 C5.2 | v15.24,59.69 15.79,59.15 R5.2 | S1.2 19.14,21.3 19.53,20.91 21.06,20.91 v21.59,20.37 | v21.63,22.9 24.66,22.9 S1.1 | S2.1 39.37,38.09 v39.37,43.18
GP0  (via drill 0.35)
  Top 0.152: U4.7 7.84,55.6 7.84,54.83 7.93,54.73 v8.35,54.73 | v7.03,51.5 7.03,51.07 7.01,51.05 7.01,47.6 8.46,46.15 8.46,44.61 v8.2,44.36 8.24,44.32 | v19.05,46.99 18.48,46.42 18.18,46.12 U1.2
  Bottom 0.152: v8.35,54.73 8.35,52.82 v7.03,51.5 | v8.2,44.36 10.18,46.33 12.95,46.33 13.25,46.02 18.09,46.02 v19.05,46.99
GP1  (via drill 0.35)
  Top 0.152: U1.3 18.46,45.83 18.76,46.14 19.9,46.14 v20.3,45.73 | v12.7,45.72 10.95,43.97 10.95,37.67 10.59,37.31 10.09,37.31 9.73,37.67 9.73,50.41 12.68,53.36 12.06,53.98 11.12,53.03 8.76,53.03 3.93,57.87 3.93,61.09 5.26,62.41 9.4,62.41 12.27,59.54 12.27,57.73 10.28,55.74 9.8,55.74 U4.10 | U4.10
  Bottom 0.152: v20.3,45.73 20.29,45.72 v12.7,45.72
GP3  (via drill 0.35)
  Top 0.152: U1.5 18.82,45.27 18.52,44.97 18.3,44.97 v17.78,44.45
  Bottom 0.152: v17.78,44.45 12.15,38.82 12.15,29.78 11.98,29.78 Q4.1
  Bottom 0.305: 11.51,29.14 Q4.1
GP4  (via drill 0.35)
  Top 0.152: v5.08,20.32 5.08,21.2 3.85,22.43 3.85,29.63 U1.6
  Bottom 0.305: v5.08,20.32 4.51,19.75 Q5.1
GP5  (via drill 0.35)
  Top 0.152: U1.7 15.97,41.18 v36.83,20.32
  Bottom 0.152: v36.83,20.32 36.98,20.32 | 36.94,20.32 Q6.1
  Bottom 0.305: v36.83,20.32 36.94,20.32
GP6  (via drill 0.35)
  Top 0.152: v10.16,15.24 10.16,11.02 9.55,10.41 9.55,9.91 9.91,9.55 10.77,9.55 J10.1 | U1.8 16.95,41.6 v16.95,41.25
  Bottom 0.152: v10.16,15.24 8.89,16.51 8.89,26.14 10.91,28.16 12.05,28.16 12.53,28.64 12.53,37.01 12.71,37.01 v16.95,41.25
GP7  (via drill 0.35)
  Top 0.152: J11.1 14.43,7.62 13.5,6.69 11.9,6.69 9.25,9.34 9.25,15.19 10.67,16.61 10.67,22.76 v10.77,22.86 | U1.9 17.62,41.71 v17.62,40.44
  Bottom 0.152: v10.77,22.86 10.77,23.5 12.96,25.69 12.96,36.76 16.64,40.44 v17.62,40.44
GP8  (via drill 0.35)
  Top 0.152: v16.51,67.36 16.51,62.23 v15.24,60.96 | v13.96,53.35 15.24,52.07 v15.24,46.67 | v20.95,45.09 20.95,43.9 U1.11
  Bottom 0.152: J18.01 17.78,68.63 v16.51,67.36 | v15.24,60.96 15.24,60.55 13.36,58.67 13.36,54.36 13.96,53.76 v13.96,53.35 | 15.49,46.92 v15.24,46.67 15.54,46.97 16.51,46.97 17.8,48.26 19.05,48.26 20.95,46.36 v20.95,45.09
GP9  (via drill 0.35)
  Top 0.152: U1.12 21,43.29 21.31,43.59 21.6,43.59 v23.07,45.06 | v21.46,52.65 21.46,58.08 22.55,59.17 22.55,60.32 v22.86,60.63 | v21.59,67.31 20.32,68.58 J18.02
  Bottom 0.152: v23.07,45.06 23.07,47.19 20.98,49.28 20.98,49.78 21.6,50.4 21.6,52.51 v21.46,52.65 | v22.86,60.63 21.59,61.9 v21.59,67.31
GP12  (via drill 0.35)
  Top 0.152: J14.1 24.13,11.84 24.74,12.45 24.74,27.28 v25.4,27.94 | v29.28,35.49 29.06,35.71 v29.06,36.98 | v28.29,39.37 26,39.37 U1.15
  Bottom 0.152: v25.4,27.94 26.98,29.52 28.36,29.52 29.26,30.43 29.26,35.47 v29.28,35.49 | v29.06,36.98 28.29,37.75 v28.29,39.37
GP13  (via drill 0.35)
  Top 0.152: U1.16 23.03,43.01 23.34,42.7 23.53,42.7 v24.04,42.2
  Bottom 0.152: v24.04,42.2 24.04,40.55 22.86,39.37 21.59,40.64 18.44,37.49 18.44,23.88 19.4,22.92 20.75,22.92 22.26,21.42 24.3,21.42 25.4,20.32 30.48,20.32 32.4,18.4 32.4,12.78 32.4,12.7 32.4,10.69 31.94,10.23 29.29,10.23 J15.1
GP14  (via drill 0.35)
  Top 0.152: U1.17 23.18,43.29 22.88,43.59 22.6,43.59 22.06,43.05 22.06,42.38 v21.59,41.91
  Bottom 0.152: J16.1 30.52,8.93 39.88,8.93 40.6,8.21 40.6,7.19 36.09,2.69 8.36,2.69 3.4,7.64 3.4,31.84 16.93,45.36 18.16,45.36 21.59,41.93 v21.59,41.91
GP15  (via drill 0.35)
  Top 0.152: J17.1 31.75,24.13 v29.21,26.67 | v30.55,36.76 30.48,36.83 v30.48,39.37 | U1.18 24.27,42.8 24.29,42.8 26.45,40.64 v28.29,40.64
  Bottom 0.152: v29.21,26.67 29.21,29.95 30.03,30.77 30.03,35.11 30.55,35.63 v30.55,36.76 | v30.48,39.37 29.21,40.64 v28.29,40.64
GP16  (via drill 0.35)
  Top 0.152: U1.27 26.14,46.12 26.45,45.81 26.64,45.81 v26.86,45.59 | v26.24,35.99 24.79,34.54 24.79,34.04 26.42,32.42 v26.42,32
  Bottom 0.152: v26.24,35.99 26.24,44.13 26.86,44.75 v26.86,45.59 | 27.53,31.88 LS1.P 26.67,31.75 v26.42,32
GP17  (via drill 0.35)
  Top 0.152: v22.86,33.02 20.93,31.09 20.93,20.4 20.75,20.22 20.32,20.22 19.36,19.26 19.36,17.56 17.78,15.98 J12.1 | v30.48,45.72 29.46,45.72 28.86,46.33 26.4,46.33 U1.28
  Bottom 0.152: v30.48,45.72 31.39,44.81 31.39,38.45 24.74,31.8 24.74,27.69 23.11,26.06 22.61,26.06 22.25,26.42 22.25,31.16 22.86,31.77 v22.86,33.02
GP18  (via drill 0.35)
  Top 0.152: U1.29 26.36,47.61 v27.74,47.61 | v28.6,45.72 28.6,44.65 29.82,43.43 29.82,38.71 v25.4,34.29 | 23.08,10.38 22.86,10.16 | 22.86,10.16 J13.1 | v22.86,26.67 v22.86,20.37 | v22.86,14.88 22.86,10.16
  Bottom 0.152: v27.74,47.61 28.6,46.75 v28.6,45.72 | v25.4,34.29 25.4,33.88 23.52,32 23.52,27.33 v22.86,26.67 | v22.86,14.88 23.86,15.88 27.16,15.88 28.55,17.26 28.55,18.03 28.19,18.39 24.85,18.39 v22.86,20.37
GP19  (via drill 0.35)
  Top 0.152: D2.1 23.84,53.63 24.79,52.68 24.79,50.55 25.15,50.19 26.67,50.19 26.57,50.29 26.57,50.83 26.6,50.8 v27.94,50.8 | 26.35,48.17 U1.30 26.7,48.52 v27.43,48.52
  Bottom 0.152: 28.8,50 28.8,49.94 | 28.8,49.94 28.8,48.54 27.45,48.54 v27.43,48.52 | v27.94,50.8 28.8,49.94
GP20  (via drill 0.35)
  Top 0.152: U1.31 26.79,49.17 v26.8,49.17 | v24.13,63.5 24.13,63.03 D2.3
  Bottom 0.152: v26.8,49.17 25.77,50.19 25.15,50.19 24.13,51.21 v24.13,63.5
GP21  (via drill 0.35)
  Top 0.152: D2.5 22.33,62.71 22.33,61.79 22.89,61.23 23.11,61.23 23.82,61.95 24.01,61.95 25.4,60.56 v25.4,50.8 | U1.32 25.48,48.33 24.94,47.79 25.74,46.99 27.98,46.99 28.62,47.63 28.62,48.62 v28.07,49.17
  Bottom 0.152: v25.4,50.8 26.67,50.8 28.07,49.4 v28.07,49.17
N$1  (via drill 0.35)
  Top 0.152: U1.26 27.69,43.91 v27.69,43.81 | v24.13,31.75 27.94,27.94 v27.94,17.78
  Bottom 0.152: R1.2 13.92,17.25 15.27,17.25 15.72,16.8 S1.4 19.8,16.8 21.11,15.49 23.01,15.49 24.32,16.8 S1.3 26.96,16.8 v27.94,17.78 | v27.69,43.81 27.69,35.31 v24.13,31.75
N$2  (via drill 0.35)
  Top 0.152: v10.16,10.16 14.76,14.76 16.13,14.76 19.05,17.68 v19.05,24.13
  Bottom 0.152: C3.1 10.16,9.75 v10.16,10.16 | v19.05,24.13 20.32,25.4 41.91,25.4 43.03,26.52 43.03,30.48 35.56,30.48 34.29,31.75 34.29,40.64 40.31,46.66 Y1.2 | 41.91,69.85 40.64,71.12 Y1.2 | Y1.2 35.1,65.91 R2.2
N$6  (via drill 0.35)
  Top 0.152: v19.05,51.44 19.05,51.41 U1.47
  Bottom 0.152: v19.05,51.44 18.46,51.44 14.61,47.58 11.73,47.58 11.6,47.72 11.6,48.8 12.15,49.36 R3.1
N$7  (via drill 0.35)
  Top 0.152: v25.63,61.19 25.63,72.62 29.21,76.2 27.77,77.64 12.87,77.64 12.7,77.47 v12.7,63.5 | v7.62,50.8 8.89,49.53 v8.89,35.56 | v13.97,21.59 13.97,24.54 14.58,25.15 14.58,27.33 v11.43,30.48
  Bottom 0.152: U3.4 25.66,62.49 25.4,62.23 25.4,61.42 v25.63,61.19 | v12.7,63.5 12.7,56.74 12.09,56.13 12.09,55.27 v7.62,50.8 | v8.89,35.56 11.43,33.02 v11.43,30.48 | v13.97,21.59 13.97,20.64 C9.1
N$8  (via drill 0.35)
  Top 0.152: v20.32,52.07 20.32,51.02 20.32,50.71 U1.46
  Bottom 0.152: v20.32,52.07 18.67,52.07 14.86,48.26 R4.1
N$10  (via drill 0.35)
  Top 0.152: v18.88,58.42 19.65,59.19 D2.2
  Bottom 0.152: v17.78,57.15 18.88,58.25 v18.88,58.42
  Bottom 0.305: R5.1 17.78,57.88 v17.78,57.15
N$12
  Bottom 0.305: LS1.N 15.66,31.75 R6.2
N$13  (via drill 0.35)
  Top 0.305: v40.64,20.32 40.64,20.62 42.59,22.58 42.59,25.36 41.91,26.05 41.91,29.21 40.64,30.48 36.83,30.48 v36.83,34.29
  Bottom 0.305: T_BATT.P1 40.64,21.67 v40.64,20.32 | v36.83,34.29 37.22,34.68 S2.2
QSPI_SCLK  (via drill 0.35)
  Top 0.152: v17.78,52.07 17.78,49.86 U1.52
  Bottom 0.152: U3.6 19.21,63.38 19.31,63.38 19.49,63.21 19.49,53.78 v17.78,52.07
QSPI_SD0  (via drill 0.35)
  Top 0.152: U1.53 18.64,48.53 17.17,50 17.17,57.98 v18.88,59.69
  Bottom 0.152: v18.88,59.69 18.45,60.12 U3.5
SCL  (via drill 0.35)
  Top 0.152: v15.5,56.24 15.5,56.55 15.85,56.9 15.85,57.4 15.49,57.76 14.99,57.76 13.11,55.88 v12.7,55.88 | v8.8,50.89 9.35,50.34 9.35,37.34 v9.99,36.7 | v11.04,35.96 13.28,38.2 17.08,37.56 v17.83,38.31 | U1.14 21.37,42.72 20.27,41.63 v20.27,40.69 24.25,40.69 26.18,38.76 28.54,38.76 28.9,39.12 28.9,41.6 v29.21,41.91 | v35.56,52.07 34.8,51.31 34.8,49.62 U7.8 34.72,49.69 v33.18,49.69 | v36.83,62.23 35.56,60.96 34.29,60.96 34.29,60.04 U6.14 | v32.36,48.77 31.85,48.26 30.48,48.26 30.48,46.58 31.09,45.97 31.09,45.47 30.48,44.86 v30.48,44.45
  Bottom 0.152: U5.13 16.41,55.63 16.41,55.92 16.09,56.24 v15.5,56.24 | v12.7,55.88 12.7,54.78 v8.8,50.89 | v9.99,36.7 10.29,36.7 11.03,35.96 v11.04,35.96 | v35.56,52.07 35.56,53.34 39.37,57.15 39.37,59.69 v36.83,62.23 | v33.18,49.69 32.36,48.87 v32.36,48.77 | v20.27,40.69 20.27,40.31 18.4,38.43 17.95,38.43 v17.83,38.31 | v29.21,41.91 29.57,42.27 29.59,42.27 30.48,43.16 v30.48,44.45
SDA  (via drill 0.35)
  Top 0.152: v14.07,36.83 12.56,35.32 v10.4,35.32 | v10.34,37.92 10.34,50.58 13.76,54 14.22,54 14.58,54.36 14.58,56.49 v15.24,57.15 | v38.1,52.07 38.1,58.61 36.21,60.49 36.02,60.49 35.47,59.94 U6.13 | v36.83,50.8 36.83,50.43 36.57,50.17 36.57,49.82 U7.7 36.2,50.16 v35.56,50.8 | v33.02,50.8 v30.48,50.8 | U1.13 18.94,40.75 18.39,40.21 v18.39,39.78 | v33.02,26.67 34.29,25.4 v34.29,24.13 | v26.67,24.13 26.67,24.86 27.28,25.47 27.28,26.92 25.65,28.55 22.61,28.55 22,27.94 21.59,27.94 v21.59,29.21 | v20.32,30.48 19.5,30.48 19.3,30.68 15.65,30.68 v14.58,31.75
  Bottom 0.152: 14.29,36.83 v14.07,36.83 | v10.4,35.32 9.07,36.65 v10.34,37.92 | U5.14 16.91,55.63 16.91,55.92 15.68,57.15 v15.24,57.15 | v38.1,52.07 v36.83,50.8 | v35.56,50.8 v33.02,50.8 | v14.07,36.83 14.38,36.83 17.1,39.55 18.15,39.55 v18.39,39.78 | v30.48,50.8 30.48,46.58 31.7,45.36 31.7,27.99 v33.02,26.67 | v34.29,24.13 v26.67,24.13 | v21.59,29.21 v20.32,30.48 | v14.58,31.75 14.2,32.12 14.19,32.12 14.05,32.26 14.05,34.55 14.07,34.57 v14.07,36.83
T112V  (via drill 0.35)
  Top 0.305: v7.62,26.67 9.55,24.74 v9.55,24.49
  Bottom 0.305: T_PY1.P0 6.35,27.94 v7.62,26.67 | v9.55,24.49 9.55,25.04 9.48,25.12 9.48,25.68 9.88,26.08 10.19,26.08 Q4.2
T212V
  Bottom 0.305: 5.46,13.08 T_PY2.P0 6.41,14.03 Q5.2
T312V  (via drill 0.35)
  Top 0.305: v39.37,20.32 T_PY3.P0
  Bottom 0.305: Q6.2 39.37,19.79 v39.37,20.32
VREG_IN  (1 unrouted)
VREG_OUT  (via drill 0.35)
  Top 0.152: v25.22,46.63 24.61,46.03 24.61,45.39 24.91,45.09 U1.23 v25.52,44.38 | U1.45 20.9,50.59 21.21,50.29 21.21,49.91 v21.59,49.53 21.03,48.97 19.89,48.97 19.59,49.28 U1.50 | v22.86,27.94 22.86,27.53 24.35,26.04 24.35,16.83 24.13,16.61 v24.13,12.7
  Bottom 0.152: v25.22,46.63 22.32,49.53 v21.59,49.53 | v22.86,27.94 23.22,28.3 23.22,32.13 24.79,33.7 24.79,34.54 25.52,35.27 v25.52,44.38 | v24.13,12.7 24.13,11.69 C1.1
  Bottom 0.305: C7.1 27.71,11.49 26.7,12.51 25.36,12.51 24.35,11.49 C1.1
VSS  (via drill 0.35)
  Top 0.152: U4.30 U4.31 5.76,59.78 v5.76,60.26 | U4.30 6.54,59.7 | 9.8,61.27 9.8,61.58 9.27,62.11 8.08,62.11 7.63,61.66 7.63,61.23 6.57,60.17 6.57,59.85 6.73,59.69 U4.30 | 9.8,61.27 9.63,61.1 U4.23 | 9.8,61.27 9.97,61.1 10.28,61.1 11.57,59.81 11.57,59.5 11.4,59.33 U4.18 U4.17 | v9.33,54.64 8.5,55.48 U4.8
  Bottom 0.152: v5.76,60.26 9.33,56.69 v9.33,54.64
XIN  (via drill 0.35)
  Top 0.152: v29.21,43.18 27.94,41.91 26.67,41.91 | 26.67,41.91 26.29,41.91 U1.20 | 26.67,41.91 27.05,41.53 v27.05,41.25 | v26.85,38.1 24.31,35.56 v24.13,35.56 | v12.7,18.39 18.44,24.13 18.44,24.38 20.32,26.26 20.32,28.8 v19.05,30.07 | v11.43,15.24 11.43,13.01 v11.12,12.7
  Bottom 0.152: Y1.1 29.21,69.52 v29.21,43.18 | v27.05,41.25 27.05,38.23 26.92,38.1 v26.85,38.1 | v24.13,35.56 19.05,30.48 v19.05,30.07 | v12.7,18.39 12.7,17.71 12.18,17.19 12.18,15.99 v11.43,15.24 | v11.12,12.7 9.85,11.43 C4.1
XOUT  (via drill 0.35)
  Top 0.152: 24.86,43.91 U1.21 26.25,42.52 v27.05,42.52
  Bottom 0.152: R2.1 29.82,56.93 29.82,42.93 29.46,42.57 28.96,42.57 28.6,42.93 28.6,43.76 27.94,44.42 27.43,44.42 27,43.99 27,42.57 v27.05,42.52

### Text on the board
tNames: PY1 | BATT | + | + | _ | _ | PY2 | PY3 | + | FINS | TVC | + | y- | y | z- | z | y- | y | z- | z | _ | _